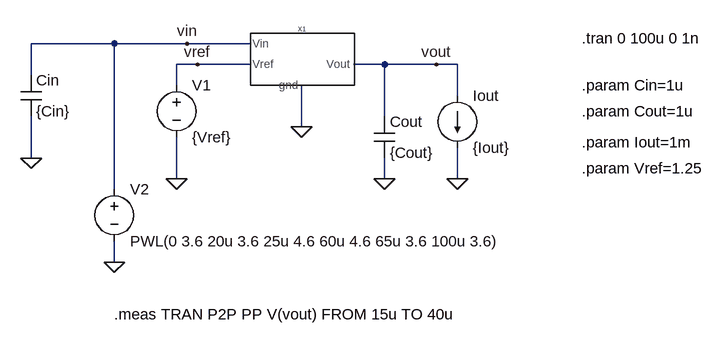
[diagram p0: schematic Line Transient_6p28.asc]
Line Transient_6p28.asc, the LTspice schematic file:
Version 4
SHEET 1 880 680
WIRE -112 48 -240 48
WIRE 0 48 -112 48
WIRE 96 48 0 48
WIRE 16 80 -16 80
WIRE 96 80 16 80
WIRE 304 80 256 80
WIRE 384 80 304 80
WIRE 416 80 384 80
WIRE -240 96 -240 48
WIRE -16 112 -16 80
WIRE 416 128 416 80
WIRE 304 160 304 80
WIRE 176 176 176 112
WIRE -240 224 -240 160
WIRE -16 256 -16 192
WIRE 304 256 304 224
WIRE 416 256 416 208
WIRE -112 272 -112 48
WIRE -112 384 -112 352
FLAG -16 256 0
FLAG 16 80 vref
FLAG 0 48 vin
FLAG 304 256 0
FLAG 416 256 0
FLAG 384 80 vout
FLAG 176 176 0
FLAG -112 384 0
FLAG -240 224 0
SYMBOL LDO_basic 176 64 R0
SYMATTR InstName X1
SYMBOL voltage -16 96 R0
WINDOW 123 0 0 Left 0
WINDOW 39 0 0 Left 0
SYMATTR InstName V1
SYMATTR Value {Vref}
SYMBOL cap 288 160 R0
SYMATTR InstName Cout
SYMATTR Value {Cout}
SYMBOL current 416 128 R0
WINDOW 123 0 0 Left 0
WINDOW 39 0 0 Left 0
SYMATTR InstName Iout
SYMATTR Value {Iout}
SYMBOL voltage -112 256 R0
WINDOW 123 24 44 Left 2
WINDOW 39 0 0 Left 0
SYMATTR InstName V2
SYMATTR Value PWL(0 3.6 20u 3.6 25u 4.6 60u 4.6 65u 3.6 100u 3.6)
SYMBOL cap -256 96 R0
SYMATTR InstName Cin
SYMATTR Value {Cin}
TEXT 608 40 Left 2 !.tran 0 100u 0 1n
TEXT 608 200 Left 2 !.param Iout=1m
TEXT 608 152 Left 2 !.param Cout=1u
TEXT 608 112 Left 2 !.param Cin=1u
TEXT 608 240 Left 2 !.param Vref=1.25
TEXT -112 464 Left 2 !.meas TRAN P2P PP V(vout) FROM 15u TO 40u

The netlist it stands for:
* Line Transient_6p28.asc
XX1 vin vref 0 vout LDO_basic  ; pins Vin Vref gnd Vout
V1 vref 0 {Vref}
Cout vout 0 {Cout}
Iout vout 0 {Iout}
V2 vin 0 PWL(0 3.6 20u 3.6 25u 4.6 60u 4.6 65u 3.6 100u 3.6)
Cin vin 0 {Cin}
.tran 0 100u 0 1n
.param Iout=1m
.param Cout=1u
.param Cin=1u
.param Vref=1.25
.meas TRAN P2P PP V(vout) FROM 15u TO 40u
.backanno
.end